# EAGLE design 20x20_adapter_v2 (EAGLE 9.4.2)
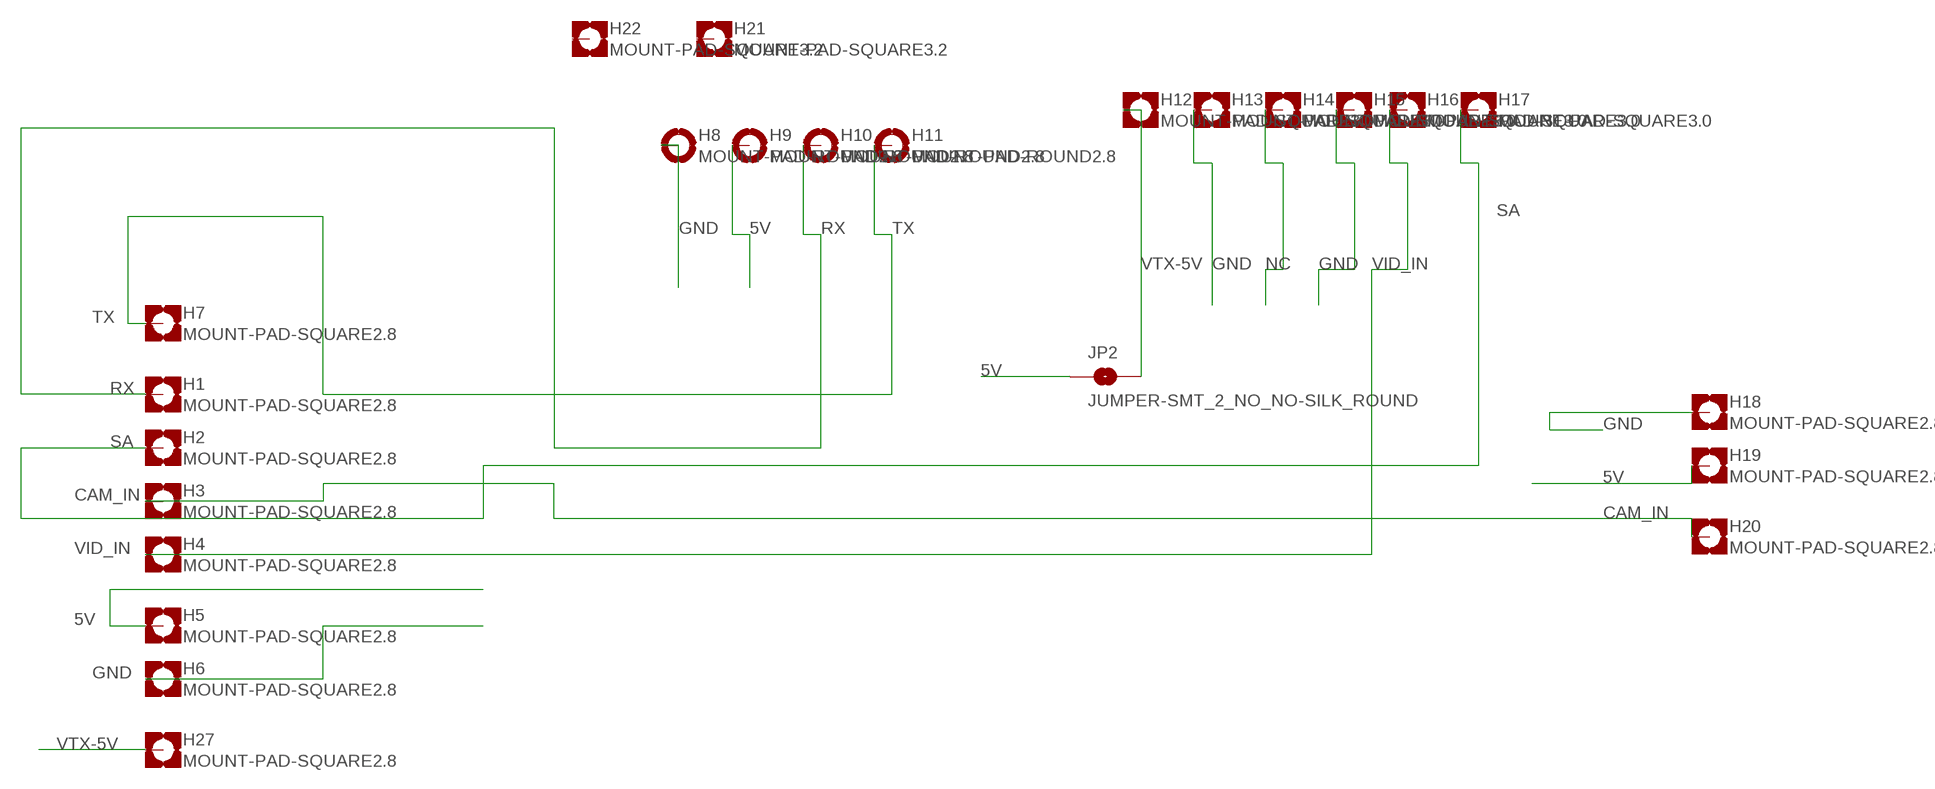
[diagram p0: schematic, sheet 1]

## Parts
H1  MOUNT-PAD-SQUARE2.8  [2,8-PAD-SQUARE]
H2  MOUNT-PAD-SQUARE2.8  [2,8-PAD-SQUARE]
H3  MOUNT-PAD-SQUARE2.8  [2,8-PAD-SQUARE]
H4  MOUNT-PAD-SQUARE2.8  [2,8-PAD-SQUARE]
H5  MOUNT-PAD-SQUARE2.8  [2,8-PAD-SQUARE]
H6  MOUNT-PAD-SQUARE2.8  [2,8-PAD-SQUARE]
H7  MOUNT-PAD-SQUARE2.8  [2,8-PAD-SQUARE]
H8  MOUNT-PAD-ROUND2.8  [1,0-PAD]
H9  MOUNT-PAD-ROUND2.8  [1,0-PAD]
H10  MOUNT-PAD-ROUND2.8  [1,0-PAD]
H11  MOUNT-PAD-ROUND2.8  [1,0-PAD]
H12  MOUNT-PAD-SQUARE3.0  [1,5-PAD-SQUARE]
H13  MOUNT-PAD-SQUARE3.0  [1,5-PAD-SQUARE]
H14  MOUNT-PAD-SQUARE3.0  [1,5-PAD-SQUARE]
H15  MOUNT-PAD-SQUARE3.0  [1,5-PAD-SQUARE]
H16  MOUNT-PAD-SQUARE3.0  [1,5-PAD-SQUARE]
H17  MOUNT-PAD-SQUARE3.0  [1,5-PAD-SQUARE]
H18  MOUNT-PAD-SQUARE2.8  [2,8-PAD-SQUARE]
H19  MOUNT-PAD-SQUARE2.8  [2,8-PAD-SQUARE]
H20  MOUNT-PAD-SQUARE2.8  [2,8-PAD-SQUARE]
H21  MOUNT-PAD-SQUARE3.2  [3,2-PAD-SQUARE]
H22  MOUNT-PAD-SQUARE3.2  [3,2-PAD-SQUARE]
H27  MOUNT-PAD-SQUARE2.8  [2,8-PAD-SQUARE]
JP2  JUMPER-SMT_2_NO_NO-SILK_ROUND  [SMT-JUMPER_2_NO_NO-SILK_ROUND]

## Nets
5V: H5.P$2(MOUNT) H9.B1,0(MOUNT) H19.P$2(MOUNT) JP2.1
CAM_IN: H3.P$2(MOUNT) H20.P$2(MOUNT)
GND: H6.P$2(MOUNT) H8.B1,0(MOUNT) H13.P$1(MOUNT) H15.P$1(MOUNT) H18.P$2(MOUNT)
NC: H14.P$1(MOUNT)
RX: H1.P$2(MOUNT) H10.B1,0(MOUNT)
SA: H2.P$2(MOUNT) H17.P$1(MOUNT)
TX: H7.P$2(MOUNT) H11.B1,0(MOUNT)
VID_IN: H4.P$2(MOUNT) H16.P$1(MOUNT)
VTX-5V: H12.P$1(MOUNT) H27.P$2(MOUNT) JP2.2
Unconnected: H21.P$1(MOUNT) H22.P$1(MOUNT)

## Library data of the parts
H1-H7 H12-H22 H27 = holes_custom:MOUNT-PAD-SQUARE: MOUNTING PAD, square
H8-H11 = holes_custom:MOUNT-PAD-ROUND: MOUNTING PAD, round
JP2 = SparkFun-Jumpers:JUMPER-SMT_2_NO: Normally open jumper This jumper has two pads in close proximity to each other. Apply solder to close the connection. Round pads are easier to solder for beginners, but are a lot larger. SparkFun Product that uses the round pads: SparkFun EL Sequencer <https://www.sparkfun.com/products/12781>

## Board
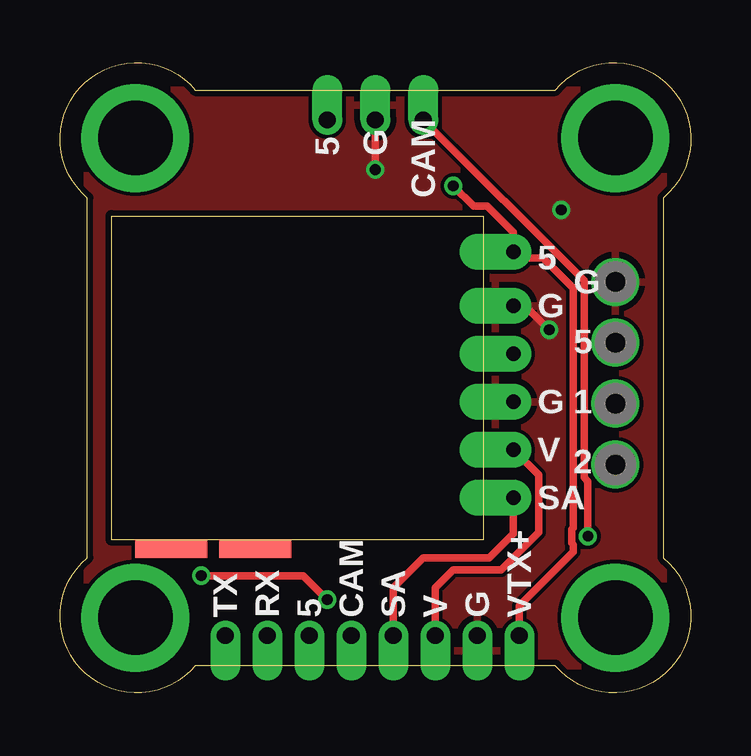
[diagram p1: board, top side]
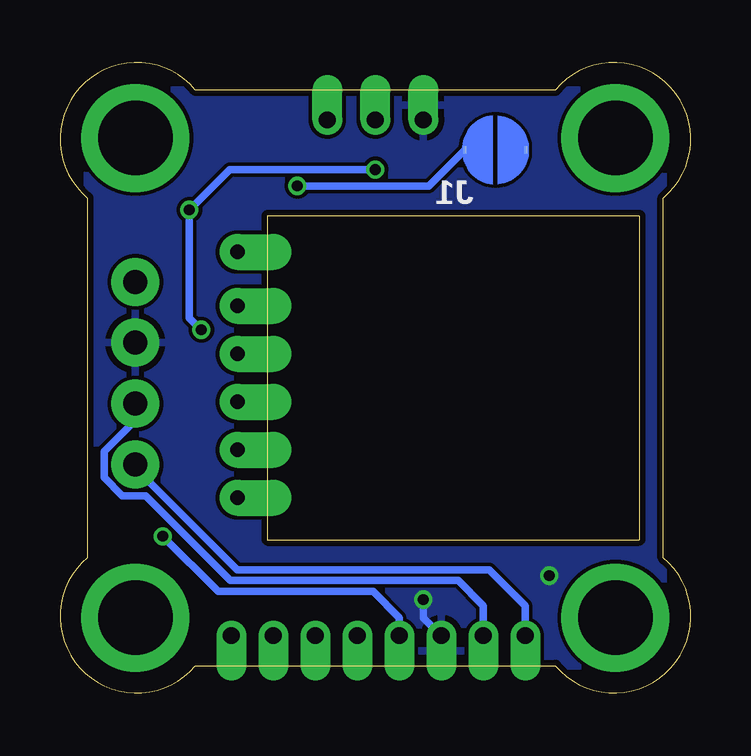
[diagram p2: board, bottom side, seen from below]

Size 26.28 x 26.28 mm. Coordinates in mm from the lower left corner, seen from the top.
Outline: 2.14,19.89 17.64,19.89 17.64,6.39 2.14,6.39 2.14,19.89
Outline: 5.64,25.14 20.64,25.14 arc-190 25.14,20.64 25.14,5.64 arc-190 20.64,1.14 5.64,1.14 arc-190 1.14,5.64 1.14,20.64 arc-190 5.64,25.14
Copper layers (1*16): Top 0.035mm / dielectric 1.5mm / Bottom 0.035mm
Design rules "SeeedStudio_2layer_DRU_no_angle_20140221": minimum track width 6mil, minimum drill 12mil, track to track 6mil, track to pad 6mil, pad to pad 6mil, via to via 6mil, smd to smd 0mil, copper to edge 10mil, drill to drill 10mil, minimum pad ring 10mil, minimum via ring 6mil, stop-mask expansion 2mil, vias tented up to drill 100mil, thermal gap 10mil
tRestrict: area 2.1,6.4 to 17.6,19.9

### Footprints (pad centres in the part's own frame; a part is rotated, then mirrored left to right if it is on the bottom)
2,8-PAD-SQUARE = drill 0.7 pad 1.25 offset: P$2 0.5,0
1,0-PAD = drill 1 pad 2: B1,0 0,0
1,5-PAD-SQUARE = drill 0.6 pad 1.5 offset: P$1 0,0
3,2-PAD-SQUARE = smd 3 x 0.75: P$1 0,0
SMT-JUMPER_2_NO_NO-SILK_ROUND = smd 0.152 x 0.305: 1 -1.27,0; 2 1.27,0

### Placement (x,y rotation side)
H1  8.64,1.89 90 top
H2  13.89,1.89 90 top
H3  12.14,1.89 90 top
H4  15.64,1.89 90 top
H5  11.14,24.39 270 bottom
H6  13.14,24.39 270 top
H7  6.89,1.89 90 top
H8  23.14,17.14 0 top
H9  23.14,14.6 90 top
H10  23.14,12.06 0 top
H11  23.14,9.52 0 top
H12  18.89,18.39 0 top
H13  18.89,16.14 0 top
H14  18.89,14.14 0 top
H15  18.89,12.14 0 top
H16  18.89,10.14 0 top
H17  18.89,8.14 0 top
H18  17.39,1.89 90 top
H19  10.39,1.89 90 top
H20  15.14,24.39 270 top
H21  4.64,6.01 0 top
H22  8.14,6.01 0 top
H27  19.14,1.89 90 top
JP2  8.14,22.64 180 bottom

### Tracks (layer width: path | path; a pad name or v marks a point on that pad's centre or on a via)
5V  (via drill 0.45)
  Top 0.305: v11.14,3.89 10.14,4.89 v5.89,4.89
  Bottom 0.305: v11.14,3.89 11.14,3.14 H19.P$2
  pour Bottom: 1.14,25.14 25.14,25.14 25.14,1.14 1.14,1.14
CAM_IN  (via drill 0.45)
  Top 0.305: v22,6.53 22,8.82 21.83,8.98 21.83,17.19 H20.P$2
  Bottom 0.305: H3.P$2 12.14,3.14 13.23,4.23 19.69,4.23 v22,6.53
GND  (via drill 0.45)
  Top 0.305: H6.P$2 v13.14,21.82 | H13.P$1 19.39,16.14 v20.39,15.14
  Bottom 0.305: v20.39,15.14 20.89,15.64 v20.89,20.14 19.21,21.82 v13.14,21.82
  pour Top: 1.14,1.14 25.14,1.14 25.14,25.14 1.14,25.14
N$1  (via drill 3.1 pad 4.5)
  other vias: 3.14,3.14
N$2  (via drill 3.1 pad 4.5)
  other vias: 3.14,23.14
N$3  (via drill 3.1 pad 4.5)
  other vias: 23.14,3.14
N$4  (via drill 3.1 pad 4.5)
  other vias: 23.14,23.14
RX
  Bottom 0.305: H1.P$2 8.64,3.64 9.68,4.68 19.18,4.68 22.71,8.21 23.68,8.21 24.44,8.98 24.44,10.06 23.14,11.36 H10.B1,0
SA
  Top 0.305: H2.P$2 13.89,4.39 15.14,5.64 17.89,5.64 18.89,6.64 H17.P$1
TX
  Bottom 0.305: H7.P$2 6.89,3.64 8.39,5.14 18.89,5.14 23.14,9.39 H11.B1,0
VID_IN
  Top 0.305: H4.P$2 15.64,4.39 16.39,5.14 18.39,5.14 19.94,6.69 19.94,9.08 H16.P$1
VTX-5V  (via drill 0.45)
  Top 0.305: v16.39,21.14 17.23,20.3 17.81,20.3 18.89,19.21 H12.P$1 19.14,18.14 20.13,18.14 21.38,16.89 21.38,6.88 21.31,6.81 21.31,6.25 21.39,6.17 21.39,5.89 19.14,3.64 H27.P$2
  Bottom 0.305: v16.39,21.14 10.91,21.14 JP2.2

### Text on the board
tNames: 5 | G | CAM | 5 | G | G | 5 | G | 1 | V | 2 | SA | TX | RX | 5 | CAM | SA | V | G | VTX+
bNames: J1